# EAGLE board PC_PIC (EAGLE 7.7.0), part 1 of 2
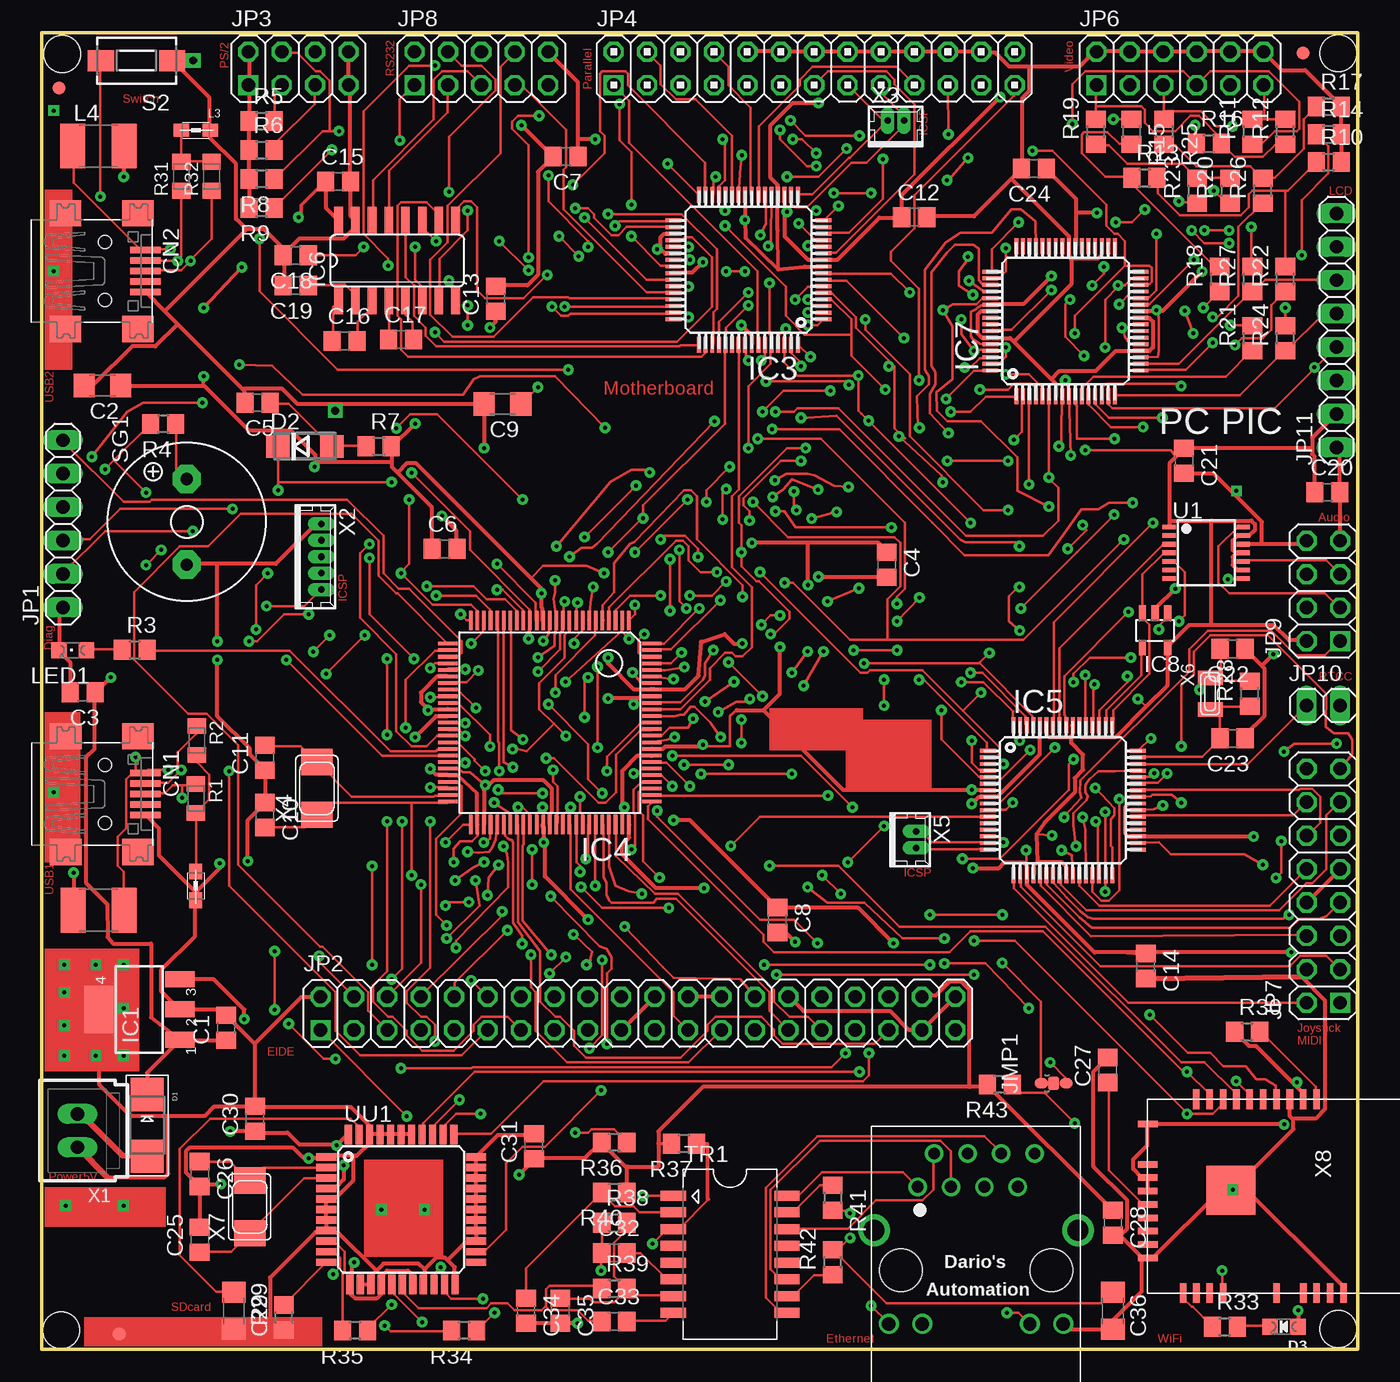
[diagram p3: board, top side]
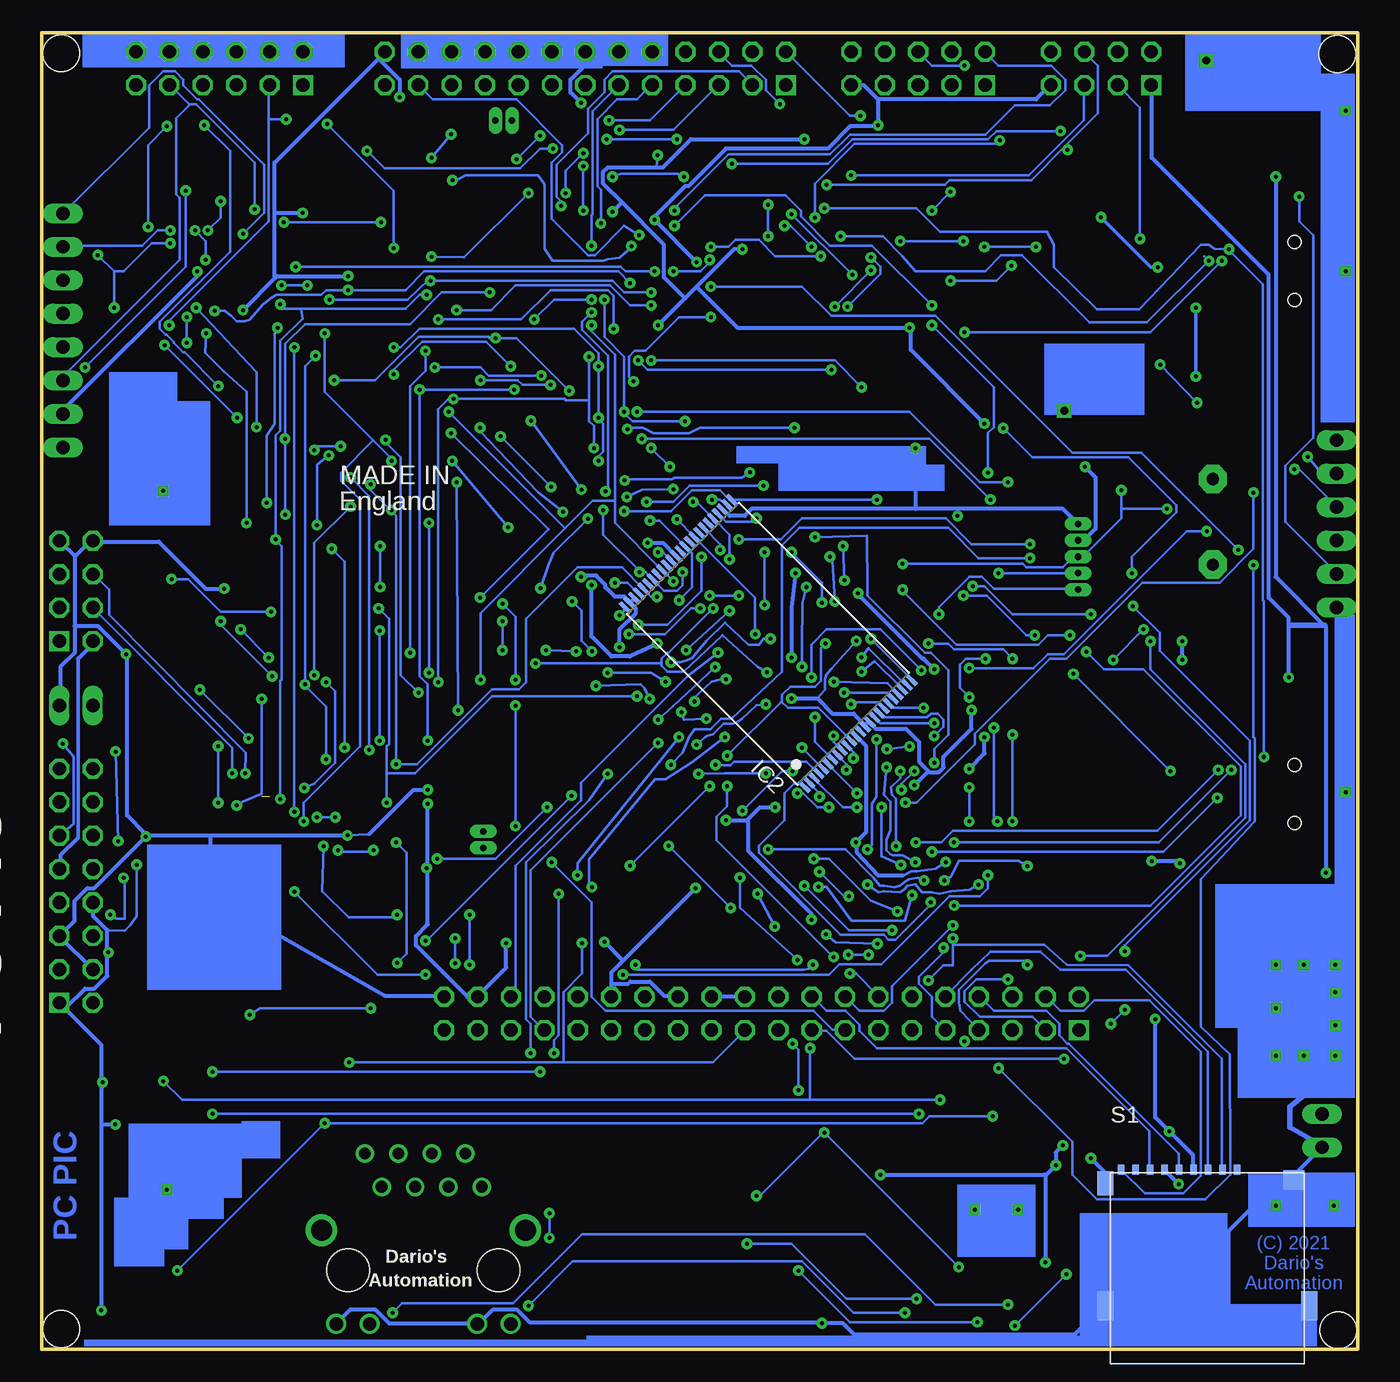
[diagram p4: board, bottom side, seen from below]

Size 100 x 100 mm. Coordinates in mm from the lower left corner, seen from the top.
Outline: 0,100 100,100 100,0 0,0 0,100
Copper layers (1*16): Top 0.035mm / dielectric 1.5mm / Bottom 0.035mm
Design rules "default *": minimum track width 8mil, minimum drill 12mil, track to track 6mil, track to pad 6mil, pad to pad 6mil, via to via 6mil, smd to smd 6mil, copper to edge 30mil, drill to drill 12mil, minimum pad ring 10mil, minimum via ring 10mil, stop-mask expansion 1mil, vias tented up to drill 0mil, thermal gap 10mil
Net classes: 1 +3V3: width 0.305 mm, clearance 0.152 mm; 2 VBUS: width 0.305 mm, clearance 0.152 mm; 4 GND: width 0.305 mm, clearance 0.152 mm; 5 +5V: width 0.305 mm, clearance 0.152 mm; 6 USBVCC: width 0.305 mm, clearance 0.152 mm
Holes 2.8 mm at 98.54,98.46 98.54,1.52 1.54,98.4 1.47,1.44

## Footprints (pad centres in the part's own frame; a part is rotated, then mirrored left to right if it is on the bottom)
C0805 = smd 1.3 x 1.5: 1 -0.95,0; 2 0.95,0
C1206 = smd 1.6 x 1.8: 1 -1.4,0; 2 1.4,0
USB-MINIB = smd 0.5 x 2.308: D+ 0,4.064; D- -0.8,4.064; GND 1.6,4.064; ID 0.8,4.064; VBUS -1.6,4.064 | smd 2 x 2.4: GND1 -4.4,-2; GND2 -4.4,3.5; GND3 4.4,3.5; GND4 4.4,-2 | hole 1: -2.2,1; 2.2,1
SMADIODE = smd 2.54 x 2.54: A 2.349,0; C -2.349,0
DO214AC = smd 1.8 x 1.7: A 2.05,0; C -2.05,0
CHIPLED_0805_NOOUTLINE = smd 1.2 x 1.2: A 0,-1.05; C 0,1.05
FIDUCIAL_1MM = smd 1 x 1: 1 0,0
SOT223 = smd 1.219 x 2.235: 1 -2.311,-3.099; 2 0,-3.099; 3 2.311,-3.099 | smd 3.6 x 2.2: 4 0,3.099
TSOP48 = smd 1.1 x 0.3: 1 -9.625,5.75; 2 -9.625,5.25; 3 -9.625,4.75; 4 -9.625,4.25; 5 -9.625,3.75; 6 -9.625,3.25; 7 -9.625,2.75; 8 -9.625,2.25; 9 -9.625,1.75; 10 -9.625,1.25; 11 -9.625,0.75; 12 -9.625,0.25; 13 -9.625,-0.25; 14 -9.625,-0.75; 15 -9.625,-1.25; 16 -9.625,-1.75; 17 -9.625,-2.25; 18 -9.625,-2.75; 19 -9.625,-3.25; 20 -9.625,-3.75; 21 -9.625,-4.25; 22 -9.625,-4.75; 23 -9.625,-5.25; 24 -9.625,-5.75; 25 9.625,-5.75; 26 9.625,-5.25; 27 9.625,-4.75; 28 9.625,-4.25; 29 9.625,-3.75; 30 9.625,-3.25; 31 9.625,-2.75; 32 9.625,-2.25; 33 9.625,-1.75; 34 9.625,-1.25; 35 9.625,-0.75; 36 9.625,-0.25; 37 9.625,0.25; 38 9.625,0.75; 39 9.625,1.25; 40 9.625,1.75; 41 9.625,2.25; 42 9.625,2.75; 43 9.625,3.25; 44 9.625,3.75; 45 9.625,4.25; 46 9.625,4.75; 47 9.625,5.25; 48 9.625,5.75
TQFP64-10X10 = smd 1.2 x 0.3: 1 -5.7,3.75; 2 -5.7,3.25; 3 -5.7,2.75; 4 -5.7,2.25; 5 -5.7,1.75; 6 -5.7,1.25; 7 -5.7,0.75; 8 -5.7,0.25; 9 -5.7,-0.25; 10 -5.7,-0.75; 11 -5.7,-1.25; 12 -5.7,-1.75; 13 -5.7,-2.25; 14 -5.7,-2.75; 15 -5.7,-3.25; 16 -5.7,-3.75; 33 5.7,-3.75; 34 5.7,-3.25; 35 5.7,-2.75; 36 5.7,-2.25; 37 5.7,-1.75; 38 5.7,-1.25; 39 5.7,-0.75; 40 5.7,-0.25; 41 5.7,0.25; 42 5.7,0.75; 43 5.7,1.25; 44 5.7,1.75; 45 5.7,2.25; 46 5.7,2.75; 47 5.7,3.25; 48 5.7,3.75 | smd 0.3 x 1.2: 17 -3.75,-5.7; 18 -3.25,-5.7; 19 -2.75,-5.7; 20 -2.25,-5.7; 21 -1.75,-5.7; 22 -1.25,-5.7; 23 -0.75,-5.7; 24 -0.25,-5.7; 25 0.25,-5.7; 26 0.75,-5.7; 27 1.25,-5.7; 28 1.75,-5.7; 29 2.25,-5.7; 30 2.75,-5.7; 31 3.25,-5.7; 32 3.75,-5.7; 49 3.75,5.7; 50 3.25,5.7; 51 2.75,5.7; 52 2.25,5.7; 53 1.75,5.7; 54 1.25,5.7; 55 0.75,5.7; 56 0.25,5.7; 57 -0.25,5.7; 58 -0.75,5.7; 59 -1.25,5.7; 60 -1.75,5.7; 61 -2.25,5.7; 62 -2.75,5.7; 63 -3.25,5.7; 64 -3.75,5.7
TQFP100-14X14 = smd 0.27 x 1.5: 1 -6,-7.75; 2 -5.5,-7.75; 3 -5,-7.75; 4 -4.5,-7.75; 5 -4,-7.75; 6 -3.5,-7.75; 7 -3,-7.75; 8 -2.5,-7.75; 9 -2,-7.75; 10 -1.5,-7.75; 11 -1,-7.75; 12 -0.5,-7.75; 13 0,-7.75; 14 0.5,-7.75; 15 1,-7.75; 16 1.5,-7.75; 17 2,-7.75; 18 2.5,-7.75; 19 3,-7.75; 20 3.5,-7.75; 21 4,-7.75; 22 4.5,-7.75; 23 5,-7.75; 24 5.5,-7.75; 25 6,-7.75; 51 6,7.75; 52 5.5,7.75; 53 5,7.75; 54 4.5,7.75; 55 4,7.75; 56 3.5,7.75; 57 3,7.75; 58 2.5,7.75; 59 2,7.75; 60 1.5,7.75; 61 1,7.75; 62 0.5,7.75; 63 0,7.75; 64 -0.5,7.75; 65 -1,7.75; 66 -1.5,7.75; 67 -2,7.75; 68 -2.5,7.75; 69 -3,7.75; 70 -3.5,7.75; 71 -4,7.75; 72 -4.5,7.75; 73 -5,7.75; 74 -5.5,7.75; 75 -6,7.75 | smd 1.5 x 0.27: 26 7.75,-6; 27 7.75,-5.5; 28 7.75,-5; 29 7.75,-4.5; 30 7.75,-4; 31 7.75,-3.5; 32 7.75,-3; 33 7.75,-2.5; 34 7.75,-2; 35 7.75,-1.5; 36 7.75,-1; 37 7.75,-0.5; 38 7.75,0; 39 7.75,0.5; 40 7.75,1; 41 7.75,1.5; 42 7.75,2; 43 7.75,2.5; 44 7.75,3; 45 7.75,3.5; 46 7.75,4; 47 7.75,4.5; 48 7.75,5; 49 7.75,5.5; 50 7.75,6; 76 -7.75,6; 77 -7.75,5.5; 78 -7.75,5; 79 -7.75,4.5; 80 -7.75,4; 81 -7.75,3.5; 82 -7.75,3; 83 -7.75,2.5; 84 -7.75,2; 85 -7.75,1.5; 86 -7.75,1; 87 -7.75,0.5; 88 -7.75,0; 89 -7.75,-0.5; 90 -7.75,-1; 91 -7.75,-1.5; 92 -7.75,-2; 93 -7.75,-2.5; 94 -7.75,-3; 95 -7.75,-3.5; 96 -7.75,-4; 97 -7.75,-4.5; 98 -7.75,-5; 99 -7.75,-5.5; 100 -7.75,-6
SO16 = smd 0.66 x 2.032: 1 -4.445,-3.073; 2 -3.175,-3.073; 3 -1.905,-3.073; 4 -0.635,-3.073; 5 0.635,-3.073; 6 1.905,-3.073; 7 3.175,-3.073; 8 4.445,-3.073; 9 4.445,3.073; 10 3.175,3.073; 11 1.905,3.073; 12 0.635,3.073; 13 -0.635,3.073; 14 -1.905,3.073; 15 -3.175,3.073; 16 -4.445,3.073
SOT23-5L = smd 0.55 x 1.2: 1 -0.95,-1.3; 2 0,-1.3; 3 0.95,-1.3; 4 0.95,1.3; 5 -0.95,1.3
C0R-JMP = smd 0.8 x 1: 1 0,0.938; 3 0,-0.938 | smd 1 x 0.8: 2 0,0
1X06 = drill 1.016 long: 1 -6.35,0; 2 -3.81,0; 3 -1.27,0; 4 1.27,0; 5 3.81,0; 6 6.35,0
2X20 = drill 1.016 square: 1 -24.13,-1.27 | drill 1.016 octagon: 2 -24.13,1.27; 3 -21.59,-1.27; 4 -21.59,1.27; 5 -19.05,-1.27; 6 -19.05,1.27; 7 -16.51,-1.27; 8 -16.51,1.27; 9 -13.97,-1.27; 10 -13.97,1.27; 11 -11.43,-1.27; 12 -11.43,1.27; 13 -8.89,-1.27; 14 -8.89,1.27; 15 -6.35,-1.27; 16 -6.35,1.27; 17 -3.81,-1.27; 18 -3.81,1.27; 19 -1.27,-1.27; 20 -1.27,1.27; 21 1.27,-1.27; 22 1.27,1.27; 23 3.81,-1.27; 24 3.81,1.27; 25 6.35,-1.27; 26 6.35,1.27; 27 8.89,-1.27; 28 8.89,1.27; 29 11.43,-1.27; 30 11.43,1.27; 31 13.97,-1.27; 32 13.97,1.27; 33 16.51,-1.27; 34 16.51,1.27; 35 19.05,-1.27; 36 19.05,1.27; 37 21.59,-1.27; 38 21.59,1.27; 39 24.13,-1.27; 40 24.13,1.27
2X04 = drill 1.016 square: 1 -3.81,-1.27 | drill 1.016 octagon: 2 -3.81,1.27; 3 -1.27,-1.27; 4 -1.27,1.27; 5 1.27,-1.27; 6 1.27,1.27; 7 3.81,-1.27; 8 3.81,1.27
2X13 = drill 1.016 square: 1 -15.24,-1.27 | drill 1.016 octagon: 2 -15.24,1.27; 3 -12.7,-1.27; 4 -12.7,1.27; 5 -10.16,-1.27; 6 -10.16,1.27; 7 -7.62,-1.27; 8 -7.62,1.27; 9 -5.08,-1.27; 10 -5.08,1.27; 11 -2.54,-1.27; 12 -2.54,1.27; 13 0,-1.27; 14 0,1.27; 15 2.54,-1.27; 16 2.54,1.27; 17 5.08,-1.27; 18 5.08,1.27; 19 7.62,-1.27; 20 7.62,1.27; 21 10.16,-1.27; 22 10.16,1.27; 23 12.7,-1.27; 24 12.7,1.27; 25 15.24,-1.27; 26 15.24,1.27
2X06 = drill 1.016 square: 1 -6.35,-1.27 | drill 1.016 octagon: 2 -6.35,1.27; 3 -3.81,-1.27; 4 -3.81,1.27; 5 -1.27,-1.27; 6 -1.27,1.27; 7 1.27,-1.27; 8 1.27,1.27; 9 3.81,-1.27; 10 3.81,1.27; 11 6.35,-1.27; 12 6.35,1.27
2X08 = drill 1.016 square: 1 -8.89,-1.27 | drill 1.016 octagon: 2 -8.89,1.27; 3 -6.35,-1.27; 4 -6.35,1.27; 5 -3.81,-1.27; 6 -3.81,1.27; 7 -1.27,-1.27; 8 -1.27,1.27; 9 1.27,-1.27; 10 1.27,1.27; 11 3.81,-1.27; 12 3.81,1.27; 13 6.35,-1.27; 14 6.35,1.27; 15 8.89,-1.27; 16 8.89,1.27
2X05 = drill 1.016 square: 1 -5.08,-1.27 | drill 1.016 octagon: 2 -5.08,1.27; 3 -2.54,-1.27; 4 -2.54,1.27; 5 0,-1.27; 6 0,1.27; 7 2.54,-1.27; 8 2.54,1.27; 9 5.08,-1.27; 10 5.08,1.27
1X02 = drill 1.016 long: 1 -1.27,0; 2 1.27,0
1X08 = drill 1.016 long: 1 -8.89,0; 2 -6.35,0; 3 -3.81,0; 4 -1.27,0; 5 1.27,0; 6 3.81,0; 7 6.35,0; 8 8.89,0
L1812 = smd 1.9 x 3.4: 1 -1.95,0; 2 1.95,0
0805 = smd 1.2 x 1: 1 -1.1,0; 2 1.1,0
CHIPLED_0805 = smd 1.2 x 1.2: A 0,-1.05; C 0,1.05
CT/CN0805 = smd 1.2 x 1.4: 1 -1.1,0; 2 1.1,0
R0805 = smd 1.3 x 1.5: 1 -0.95,0; 2 0.95,0
MICROSD-PUSH-OUT = smd 0.5 x 0.75: 1 9.625,0.225; 2 8.525,0.225; 3 7.425,0.225; 4 6.325,0.225; 5 5.225,0.225; 6 4.125,0.225; 7 3.025,0.225; 8 1.925,0.225; CD 0.825,0.225 | smd 1.2 x 1.8: G1 -0.375,-0.8 | smd 1.2 x 2.2: G2 -0.375,-10.1; G4 15.125,-10.1 | smd 1.6 x 1.5: G3 13.95,-0.55
DTSM-3 = smd 2 x 1.6: 1 -2.7,0; 2 2.7,0
F/QMBIII = drill 0.914 pad 2.159 octagon: + 3.251,0; - -3.251,0
01LAN_RJ45_10/00_Y-G_STD = drill 0.889: 1 4.445,-6.325; 2 3.175,-8.865; 3 1.905,-6.325; 4 0.635,-8.865; 5 -0.635,-6.325; 6 -1.905,-8.865; 7 -3.175,-6.325; 8 -4.445,-8.865 | drill 1.016: 9 6.629,4.089; 10 4.089,4.089; 11 -4.089,4.089; 12 -6.629,4.089 | drill 1.6: 16 -7.747,-3.023; 17 7.747,-3.023 | hole 3.251: -5.715,0.025; 5.715,0.025
749013011 = smd 1.91 x 0.76: 1 -4.317,4.445; 2 -4.317,3.175; 3 -4.317,1.905; 4 -4.317,0.635; 5 -4.317,-0.635; 6 -4.317,-1.905; 7 -4.317,-3.175; 8 -4.317,-4.445; 9 4.317,-4.445; 10 4.317,-3.175; 11 4.317,-1.905; 12 4.317,-0.635; 13 4.317,0.635; 14 4.317,1.905; 15 4.317,3.175; 16 4.317,4.445
TSSOP14 = smd 0.35 x 1: 1 -1.95,-2.825; 2 -1.3,-2.825; 3 -0.65,-2.825; 4 0,-2.825; 5 0.65,-2.825; 6 1.3,-2.825; 7 1.95,-2.825; 8 1.95,2.825; 9 1.3,2.825; 10 0.65,2.825; 11 0,2.825; 12 -0.65,2.825; 13 -1.3,2.825; 14 -1.95,2.825
TQFP-44 = smd 1.5 x 0.55: 1 -5.7,4; 2 -5.7,3.2; 3 -5.7,2.4; 4 -5.7,1.6; 5 -5.7,0.8; 6 -5.7,0; 7 -5.7,-0.8; 8 -5.7,-1.6; 9 -5.7,-2.4; 10 -5.7,-3.2; 11 -5.7,-4; 23 5.7,-4; 24 5.7,-3.2; 25 5.7,-2.4; 26 5.7,-1.6; 27 5.7,-0.8; 28 5.7,0; 29 5.7,0.8; 30 5.7,1.6; 31 5.7,2.4; 32 5.7,3.2; 33 5.7,4 | smd 0.55 x 1.5: 12 -3.9,-5.7; 13 -3.1,-5.7; 14 -2.3,-5.7; 15 -1.5,-5.7; 16 -0.7,-5.7; 17 0.1,-5.7; 18 0.9,-5.7; 19 1.7,-5.7; 20 2.5,-5.7; 21 3.3,-5.7; 22 4.1,-5.7; 34 4,5.7; 35 3.2,5.7; 36 2.4,5.7; 37 1.6,5.7; 38 0.8,5.7; 39 0,5.7; 40 -0.8,5.7; 41 -1.6,5.7; 42 -2.4,5.7; 43 -3.2,5.7; 44 -4,5.7
70543-02 = drill 1.016 long: 1 -1.27,0; 2 1.27,0
53047-05 = drill 0.5 pad 0.698 long: 1 2.5,0.45; 2 1.25,0.45; 3 0,0.45; 4 -1.25,0.45; 5 -2.5,0.45
53047-02 = drill 0.5 pad 0.698 long: 1 0.625,0.45; 2 -0.625,0.45
NX5032 = smd 2 x 2.4: P$1 2,0; P$2 -2,0
XTAL3215 = smd 1.1 x 1.9: P$1 1.2,0; P$2 -1.2,0
ATWINC1500_MR210PA = smd 1.5 x 0.5: J1 7.146,-4.973; J2 7.146,-3.957; J3 7.146,-2.941; J4 7.146,-1.925; J5 7.146,2.139; J6 7.146,4.171; J7 7.146,5.187; J8 7.146,6.203; J9 7.146,7.219; J10 -7.584,5.181; J11 -7.584,4.165; J12 -7.584,3.149; J13 -7.584,2.133; J14 -7.584,1.117; J15 -7.584,0.101; J16 -7.584,-0.915; J17 -7.584,-1.931; J18 -7.584,-2.947; J19 -7.584,-3.963 | smd 0.5 x 1.5: J20 -5.684,-7.643; J21 -2.636,-7.663; J22 -1.62,-7.663; J23 -0.604,-7.663; J24 0.412,-7.663; J25 1.428,-7.643; J26 2.444,-7.643; J27 3.46,-7.643; J28 4.476,-7.643 | smd 3.7 x 3.7: MTGND -0.666,-1.331

## Placement (x,y rotation side)
C1  100n  [C0805]  14,24.4 90 top
C2  22u  [C1206]  4.6,73.2 180 top
C3  100n  [C0805]  3.1,49.9 180 top
C4  100n  [C0805]  64.2,59.6 270 top
C5  100n  [C0805]  16.4,71.9 180 top
C6  100n  [C0805]  30.6,60.8 0 top
C7  100n  [C0805]  39.8,90.6 180 top
C8  100n  [C0805]  55.9,32.6 270 top
C9  4.7uF  [C1206]  35,71.8 180 top
C10  22p  [C0805]  16.95,40.58 270 top
C11  22p  [C0805]  16.95,44.92 90 top
C12  100n  [C0805]  66.3,86 0 top
C13  100n  [C0805]  34.5,79.8 90 top
C14  100n  [C0805]  83.9,29.1 270 top
C15  100n  [C0805]  22.5,88.7 0 top
C16  100n  [C0805]  23,76.6 0 top
C17  100n  [C0805]  27.3,76.7 0 top
C18  100n  [C0805]  19.3,83.1 180 top
C19  100n  [C0805]  19.3,80.8 180 top
C20  100n  [C0805]  97.7,65.1 0 top
C21  100n  [C0805]  86.8,67.5 270 top
C22  22p  [C0805]  90.5,53.2 180 top
C23  22p  [C0805]  90.5,46.4 180 top
C24  100n  [C0805]  75.4,89.7 180 top
C25  22p  [C0805]  12,8.3 90 top
C26  22p  [C0805]  12,13.3 270 top
C27  1uF  [C0805]  81,21.2 90 top
C28  100n  [C0805]  81.4,9.6 270 top
C29  10uF  [C1206]  14.6,2.9 270 top
C30  100n  [C0805]  16.2,17.5 90 top
C31  100n  [C0805]  37.4,15.4 90 top
C32  6n8  [C0805]  43.5,7.3 0 top
C33  6n8  [C0805]  43.5,2.1 0 top
C34  10n  [C0805]  36.8,2.9 270 top
C35  10n  [C0805]  39.4,2.9 270 top
C36  1n 2KV  [C1206]  81.4,2.9 270 top
CN1  MiniUSB webcam/pendrive  [USB-MINIB]  3.81,42.16 270 top
CN2  MiniUSB keyboard/mouse  [USB-MINIB]  3.8,81.9 270 top
D1  1N4007  [SMADIODE]  8,17 270 top
D2  BAT42-SMD  [DO214AC]  19.98,68.58 0 top
D3  Red  [CHIPLED_0805_NOOUTLINE]  94.4,1.7 90 top
F1  FIDUCIAL  [FIDUCIAL_1MM]  1.31,95.8 0 top
F2  FIDUCIAL  [FIDUCIAL_1MM]  95.87,98.47 0 top
F3  FIDUCIAL  [FIDUCIAL_1MM]  5.88,1.14 0 top
IC1  MCP1825S-33  [SOT223]  7.4,25.8 90 top
IC2  AS6C6416  [TSOP48]  44.8,53.6 135 bottom
IC3  PIC24FJ256GB206  [TQFP64-10X10]  53.7,82 180 top
IC4  PIC32MZ2048EFG100  [TQFP100-14X14]  38.6,47.6 180 top
IC5  PIC32MZ1024EFE064512  [TQFP64-10X10]  77.6,41.7 0 top
IC6  MAX202ECWS  [SO16]  27,82.7 0 top
IC7  PIC32MZ1024EFE064512  [TQFP64-10X10]  77.8,78.1 90 top
IC8  TC77  [SOT23-5L]  84.6,54.6 180 top
JMP1  0R-JUMPC  [C0R-JMP]  76.9,20.2 90 top
JP1  Diag  [1X06]  1.6,62.7 90 top
JP2  EIDE/PATA/floppy  [2X20]  45.3,25.5 0 top
JP3  PS/2  [2X04]  19.5,97.3 0 top
JP4  Centronics  [2X13]  58.7,97.3 0 top
JP6  Video/VGA/Comp  [2X06]  86.5,97.3 0 top
JP7  Joystick/Midi  [2X08]  97.4,35.2 90 top
JP8  RS232  [2X05]  33.4,97.3 0 top
JP9  Audio/SPDIF  [2X04]  97.4,57.6 90 top
JP10  RTC  [1X02]  97.4,48.9 0 top
JP11  [1X08]  98.4,77.4 90 top
L1  500mA  [L1812]  4.32,33.34 180 top
L2  BLM21  [0805]  11.69,35.19 90 top
L3  BLM21  [0805]  11.7,92.6 180 top
L4  500mA  [L1812]  4.3,91.4 0 top
LED1  rosso  [CHIPLED_0805]  2.34,53.1 90 top
R1  VARISTORCN0805  [CT/CN0805]  11.72,41.84 270 top
R2  VARISTORCN0805  [CT/CN0805]  11.78,46.23 270 top
R3  470  [R0805]  7.06,53.12 0 top
R4  100  [R0805]  9.21,70.28 180 top
R5  2K2  [R0805]  16.7,93.3 0 top
R6  2K2  [R0805]  16.7,91.1 0 top
R7  10K  [R0805]  25.6,68.6 0 top
R8  2K2  [R0805]  16.7,88.9 180 top
R9  2K2  [R0805]  16.7,86.7 180 top
R10  470  [R0805]  97.8,90.2 0 top
R11  220  [R0805]  92,92.5 90 top
R12  220  [R0805]  94.5,92.5 90 top
R13  220  [R0805]  83.8,89 0 top
R14  470  [R0805]  97.8,92.3 0 top
R15  220  [R0805]  82.8,92.5 270 top
R16  470  [R0805]  88.7,91.6 0 top
R17  470  [R0805]  97.8,94.4 0 top
R18  470  [R0805]  89.5,81.3 90 top
R19  220  [R0805]  80.1,92.5 90 top
R20  470  [R0805]  90.3,88 90 top
R21  470  [R0805]  92,76.8 90 top
R22  470  [R0805]  94.5,81.3 90 top
R23  220  [R0805]  87.8,88 90 top
R24  470  [R0805]  94.5,76.8 90 top
R25  220  [R0805]  85.3,92.5 270 top
R26  470  [R0805]  92.8,88 90 top
R27  470  [R0805]  92,81.3 90 top
R28  1M  [R0805]  91.8,49.8 90 top
R29  12K4 1%  [R0805]  18.4,2.4 90 top
R30  1M  [R0805]  91.6,24.1 0 top
R31  VARISTORCN0805  [CT/CN0805]  10.6,89.1 90 top
R32  VARISTORCN0805  [CT/CN0805]  12.9,89.1 90 top
R33  1K  [R0805]  89.9,1.7 0 top
R34  220  [R0805]  32.1,1.4 180 top
R35  220  [R0805]  23.8,1.4 180 top
R36  49.9 1%  [R0805]  43.5,15.7 180 top
R37  49.9 1%  [R0805]  48.8,15.6 180 top
R38  49.9 1%  [R0805]  43.5,9.6 0 top
R39  49.9 1%  [R0805]  43.5,4.6 0 top
R40  10 1%  [R0805]  43.5,11.9 180 top
R41  75 1%  [R0805]  60.1,11.5 270 top
R42  75 1%  [R0805]  60.1,6.6 90 top
R43  10K  [R0805]  72.8,20.1 180 top
S1  MICROSD-PUSH-OUT  [MICROSD-PUSH-OUT]  18.8,13.4 0 bottom
S2  DTSM-3  [DTSM-3]  7.2,97.9 180 top
SG1  F/QMBIII  [F/QMBIII]  11.01,62.85 90 top
T1  7499011121  [01LAN_RJ45_10/00_Y-G_STD]  71,6 180 top
TR1  [749013011]  52.3,7.2 0 top
U1  MCP4922TSSOP  [TSSOP14]  88.5,60.5 270 top
UU1  ENC424J600  [TQFP-44]  27.3,10.6 0 top
X1  C-GRID-02-70543  [70543-02]  2.7,16.6 90 top
X2  53047-05  [53047-05]  20.8,60.2 270 top
X3  53047-02  [53047-02]  64.9,92.9 0 top
X4  24MHz  [NX5032]  20.9,42.6 90 top
X5  53047-02  [53047-02]  66,38.7 270 top
X6  32768  [XTAL3215]  88.8,49.8 270 top
X7  25MHz  [NX5032]  15.8,10.8 90 top
X8  ATWINC1500_MR210PB  [ATWINC1500_MR210PA]  91.7,11.4 270 top

## Tracks (layer width: path | path; a pad name or v marks a point on that pad's centre or on a via)
+3V3  (via drill 0.3, 0.3 pad 0.2, 0.3 pad 0.25, 0.3 pad 0.3)
  Top 0.203: IC5.26 78.3,37.5 v77.5,37.9 | v74.8,37.9 74.85,36.5 | IC5.39 84.5,41 v85.2,41.3 | v83.3,49.4 83.96,48.84 | IC3.26 53.1,89.79 v53.2,90.7 | IC7.60 71.3,76.4 70.7,76.8 70.6,77 70.6,78.8 71,79 71.1,79.1 71.4,79.3 IC7.54 | IC7.19 84.8,75.4 84.9,75.8 84.9,78.4 v84.72,78.94 | IC7.8 77.5,70.5 77.5,69 v77.3,68.6 | v79.3,68.3 85.8,68.3 86.2,67.8 | v42.73,58.96 41.4,59.5 38.1,59.5 37.17,58.57 | 33.07,39.74 33.1,39 32.7,38.6 31.8,38.6 31.3,38 v31.3,37 | IC5.34 84.9,38.5 85.8,37.6 91.4,37.6 v92.8,36.8
  Top 0.254: 30.94,43.56 31.64,43.56 33.07,42.23 | C15.1 21.5,88.7 19.7,86.9 19.7,86.2 v19.5,86 | v15.2,82.2 v12.3,79.1 | v12.3,73.9 12.2,73.17 | R37.2 46.85,15.6
  Top 0.305: IC4.62 38.05,39.83 38.05,39.74 38.14,39.65 v38.14,38.49 38.23,38.41 38.23,35.92 v41.52,32.63 | 33.07,42.23 33.07,39.92 IC4.52 33.07,39.74 | 30.94,43.56 IC4.46 30.76,43.65 29.96,43.65 v29.52,44.09 | v28.36,46.49 29.96,48.09 IC4.37 | IC5.60 75.83,47.38 75.83,45.16 72.63,41.96 71.92,41.96 IC5.8 71.83,41.96 71.21,41.96 v70.67,41.43 | 44.09,41.16 44.09,43.92 45.25,45.07 46.32,45.07 IC4.83 | 44.09,41.16 44.09,39.92 IC4.74 | v64.72,30.85 62.05,33.52 55.92,33.52 C8.1 55.83,33.6 49.25,40.18 v48.01,40.18 | v44.27,41.16 44.09,41.16 | v70.76,36.54 72.72,36.54 73.17,36.98 74.59,36.98 74.85,36.72 74.85,36.5 74.85,36.09 IC5.19 74.85,35.92 74.85,35.29 80.01,30.14 82.5,30.14 C14.1 82.59,30.14 v94.94,30.14 | UU1.18 28.18,4.98 28.18,5.6 27.83,5.96 26.23,5.96 25.87,5.6 25.87,4.98 UU1.15 25.78,4.89 25.78,4.18 25.43,3.82 23.82,3.82 23.47,4.18 23.47,4.89 UU1.12 23.56,4.98 23.56,6.4 v23.74,6.58 | v22.94,13.96 22.94,12.89 22.31,12.27 21.6,12.27 UU1.4 | UU1.44 23.29,16.36 v22.4,15.47 22.31,15.56 19.56,15.56 18.67,16.45 16.27,16.45 C30.1 16.18,16.54 v14.31,16.54 | v15.38,25.07 15.38,25.78 13.07,28.09 10.58,28.09 IC1.3 | 44.45,13.78 R40.1 | 44.45,13.78 42.58,15.65 R36.2 42.41,15.65 41.25,14.49 37.43,14.49 C31.1 37.34,14.31 v36.27,13.25 | 44.45,13.78 44.54,13.87 46.85,13.87 46.85,15.6 46.85,16.54 50.23,19.91 70.5,19.91 | C28.1 81.34,10.58 71.83,20.09 R43.2 71.83,19.91 70.5,19.91 | 70.5,19.91 70.5,27.29 69.88,27.91 68.99,27.91 67.92,26.85 66.94,26.85 JP2.38 | 56.45,86.41 56.45,87.66 IC3.19 | 56.45,86.41 56.45,84.54 58.23,82.77 59.38,82.77 IC3.10 59.47,82.77 60.45,82.77 63.65,85.97 65.34,85.97 C12.1 65.34,86.14 65.34,87.66 v72.81,95.12
  Top 0.305: 40.72,91.92 40.72,96.28 38.49,98.5 JP8.10 | 40.72,91.92 40.72,90.68 C7.1 | v53.16,77.79 53.96,76.99 53.96,76.36 IC3.57 | IC3.38 47.92,83.21 47.38,83.21 47.03,83.57 v46.76,83.57 47.03,83.66 47.03,84.45 47.3,84.72 47.92,84.72 IC3.35 | v34.05,77.61 34.49,78.05 34.49,78.77 C13.1 | v42.05,91.92 40.72,91.92 | v56.63,86.41 56.45,86.41 | 27.03,66.59 26.58,67.03 26.58,67.39 | 27.03,66.59 29.6,64.01 29.6,60.81 C6.1 | 26.58,67.39 26.58,68.54 R7.2 26.67,68.63 v28.36,70.32 | 21.07,67.39 20.8,67.65 20.8,67.92 18.94,69.79 15.73,69.79 12.36,73.17 12.2,73.17 6.04,73.17 C2.1 | 26.58,67.39 21.07,67.39 | 21.07,67.39 v20.71,67.03 | 58.23,61.25 63.56,61.25 64.19,60.63 C4.1 | 58.23,61.25 v53.96,61.25 | v32.18,51.65 30.94,51.65 IC4.30 | IC4.14 38.05,55.38 38.05,56.27 37.96,56.36 v37.96,57.43 38.05,57.7 37.17,58.57 28.45,67.3 27.74,67.3 27.03,66.59 | v43.03,52.54 43.03,52.09 44.98,50.14 46.32,50.14 IC4.93 46.49,50.14 48.9,50.14 49.92,51.16 50.12,53.76 50.07,53.72 51.88,54.32 52.59,53.61 v53.23,53.61 | v58.23,58.05 58.23,61.25 | 95.21,20.09 92.28,23.02 91.75,23.02 90.68,24.09 R30.1 | 95.21,20.09 95.83,19.47 95.83,19.02 X8.J11 | JP7.8 96.19,33.96 98.68,36.45 JP7.9 | X8.J23 84.01,12.09 84.01,12.98 X8.J22 83.92,13.07 83.57,13.07 82.94,13.69 82.94,14.4 84.01,15.47 84.01,17.07 X8.J20 84.19,17.07 v94.41,17.07 | v95.48,2.93 95.48,1.78 D3.A | v95.39,20.27 95.21,20.09 | 90.77,60.45 90.5,60.19 90.5,59.56 90.86,59.21 91.3,59.21 U1.9 | 90.77,60.45 91.3,60.45 U1.11 | 90.77,60.45 90.5,60.72 90.5,61.43 90.86,61.78 91.3,61.78 U1.13 91.48,61.78 91.75,61.78 92.19,62.23 92.19,62.67 91.92,62.94 88.9,62.94
  Top 0.305: 85.7,62.94 85.7,67.3 86.2,67.8 86.77,68.36 C21.1 86.94,68.45 96.55,68.45 | 85.7,62.94 85.7,62.5 U1.1 | 85.7,62.94 88.9,62.94 | IC5.54 78.85,47.38 78.85,46.67 79.03,46.49 81.61,46.49 83.96,48.84 85.52,50.41 85.52,53.25 IC8.5 85.61,53.43 87.21,55.03 88.9,55.03 | 88.9,55.03 93.61,55.03 94.77,53.87 96.1,53.87 JP9.2 | 88.9,55.03 88.9,62.94 | 78.59,86.32 78.59,87.39 76.36,89.61 C24.1 | 78.59,86.32 78.59,83.83 IC7.39 | 84.72,78.85 85.17,78.85 v88.19,81.88 | 84.72,78.85 83.57,78.85 IC7.26 | v76.72,81.52 74.59,79.39 72.19,79.39 IC7.54 | v84.72,78.94 84.72,78.85 | 96.55,68.45 96.55,69.25 98.32,71.03 JP11.2 | 96.55,68.45 96.55,68.01 96.72,67.83 96.72,65.16 C20.1 | v80.19,86.32 78.59,86.32
  Bottom 0.203: v77.5,37.9 77.7,37.8 74.9,37.8 v74.8,37.9 | v85.2,41.3 85.2,41.4 83.3,42.2 v83.3,49.4 | v53.2,90.7 53.3,89.79 | v77.3,68.6 79.1,68.6 v79.3,68.3 | 34.56,35.97 33.9,36.3 33.5,36.3 32.1,36.5 v31.3,37 | v92.8,36.8 92.8,32.9 93.3,32.2 93.7,31.8 95.03,31.83
  Bottom 0.254: 97.26,52.45 97.26,38.85 | v19.5,86 15.7,82.2 v15.2,82.2 | v12.3,79.1 v12.3,73.9
  Bottom 0.305: IC2.12 38.14,46.58 37.34,45.78 37.34,39.29 v38.14,38.49 38.05,38.41 38.05,37.69 36.43,35.97 34.56,35.97 | v28.36,46.49 28.36,45.25 v29.52,44.09 | v64.72,30.85 64.72,28.98 66.85,26.85 JP2.38 67.03,26.76 67.65,26.76 71.56,30.67 71.56,31.38 70.67,32.27 70.67,36.54 | v44.27,41.16 45.43,41.16 46.41,40.18 | v48.01,40.18 46.41,40.18 | 70.67,36.54 v70.67,41.43 | v70.76,36.54 70.67,36.54 | v41.52,32.63 41.52,33.07 46.32,37.87 46.32,40.09 46.41,40.18 | v22.4,15.47 22.94,14.94 v22.94,13.96 23.74,13.16 | 23.74,13.16 v23.74,6.58 | S1.4 12.54,13.69 12.54,14.76 v14.31,16.54 15.38,17.6 v15.38,25.07 | v36.27,13.25 23.82,13.25 23.74,13.16 | 50.23,80.72 47.38,83.57 v46.76,83.57 | 50.23,80.72 51.12,79.83 | 51.12,79.83 v53.16,77.79 | 50.23,80.72 47.12,77.61 v34.05,77.61 33.96,77.52 33.96,75.92 v28.36,70.32 | v42.05,91.92 50.67,91.92 52.81,89.79 53.3,89.79 56.98,89.79 57.34,89.43 57.34,88.54 55.92,87.12 | 55.92,87.12 52.72,83.92 52.72,81.43 51.12,79.83 | 55.92,87.12 v56.63,86.41 | v20.71,67.03 19.91,66.23 19.91,62.32 20.71,61.52 21.25,61.52 X2.4 | v53.96,61.25 52.81,61.25 51.83,60.27 IC2.37 | v32.18,51.65 32.98,52.45 33.07,52.45 37.96,57.34 v37.96,57.43 | v43.03,52.54 43.03,56.36 v42.73,58.96 | v58.23,58.05 58.23,54.14 56.72,52.63 55.31,52.63 v53.23,53.61 | 95.48,20.27 95.48,23.11 98.59,26.23 JP7.1 98.15,25.96 96.72,27.38 96.01,27.38 95.03,28.36 95.03,30.14 | 95.48,20.27 95.48,17.07 | 95.48,17.07 v95.48,2.93 | 95.48,17.07 v94.41,17.07 | 95.03,30.14 95.03,31.83 96.1,32.89 96.1,33.87 JP7.8 | v95.39,20.27 95.48,20.27 | v88.19,81.88 88.19,81.52 98.32,71.39 98.32,71.12 JP11.2 | v76.72,81.52 82.14,81.52 82.23,81.43
  Bottom 0.305: v84.72,78.94 82.23,81.43 | 82.32,86.32 82.32,81.52 82.23,81.43 | 82.32,86.32 82.32,90.14 73.97,98.5 JP4.26 74.32,97.97 72.81,96.46 v72.81,95.12 | 82.32,86.32 v80.19,86.32 | 97.26,38.85 98.59,37.52 98.59,36.54 JP7.9 | 97.26,52.45 96.19,53.52 96.19,53.78 JP9.2 | v94.94,30.14 95.03,30.14
+5V  (via drill 0.3)
  Top 0.305: R9.2 15.73,86.77 15.73,88.9 R8.2 15.73,88.99 15.73,91.03 R6.1 15.73,91.21 15.73,93.26 R5.1 15.73,93.43 15.73,95.92 JP3.1 15.73,96.1 15.73,98.5 JP3.2 | 10.49,23.56 IC1.1 | C1.1 13.96,23.47 10.58,23.47 IC1.1 | D1.C 8,19.38 8,20.98 10.4,23.38 IC1.1 | v5.25,51.03 4.18,49.96 C3.1 4,49.87 4,45.61 3.38,44.98 3.38,35.38 4.98,33.78 5,31.3 5.4,30.8 8.3,30.8 8.3,25.2 IC1.1
  Bottom 0.305: v5.25,51.03 5.25,55.56 6.76,57.07 6.76,81.61 15.65,90.5 15.65,96.01 JP3.1
ACS  (via drill 0.3 pad 0.3)
  Top 0.203: IC4.56 35.2,39 35.4,38.8 35.6,38.7 35.7,38.7 35.8,38.5 35.8,32.4 36.5,31.4 v36.5,30.8 | v40.4,31.5 41.8,30.2 41.7,29.7 41.7,29.5 v41.4,29.2 | v54.9,29.2 v67.5,29.2 67.6,29.2 | IC5.45 81.6,43.9 80.3,43.9 79.6,43.3 79.4,43 79.3,42.8 79.3,42.3 79.5,42 79.4,41.7 78.4,40.7 78.4,39.8 v78.6,38.2 | v73,33 v67.5,33
  Bottom 0.203: v36.5,30.8 39.7,30.9 v40.4,31.5 | v41.4,29.2 41.7,28.9 42.1,28.8 54.7,28.8 v54.9,29.2 | v78.6,38.2 78.7,34.8 76.7,32.8 73.2,32.8 v73,33 | v67.5,33 v67.5,29.2
AIRQ  (via drill 0.3)
  Top 0.203: v52.36,38.23 54.59,40.45 71.83,40.45 IC5.11 | v47.65,33.52 42.58,33.52 v40.98,35.12 | v33.86,34.48 33.96,35.83 v34.72,36.78 | v36.18,41.16 36.54,41.16 37.07,40.63 37.07,39.92 IC4.60
  Bottom 0.203: v47.65,33.52 v52.36,38.23 | v40.98,35.12 40.36,35.12 38.48,32.54 34.4,32.54 v33.86,34.48 | v34.72,36.78 36.18,37.45 v36.18,41.16
ALDAC  (via drill 0.3)
  Top 0.203: v90.14,58.5 91.3,58.5 U1.8 | v82.59,56.01 77.7,51.12 77.7,48.18 77.79,48.09 77.79,47.47 IC5.56
  Bottom 0.203: v90.14,58.5 88.9,58.5 86.41,56.01 v82.59,56.01
ASCK
  Top 0.203: U1.4 85.61,60.45 85.25,60.45 83.66,58.85 83.66,55.92 IC8.3 83.66,55.83 83.66,55.56 84.19,55.03 84.19,51.3 81.43,48.54 81.43,47.47 IC5.49
ASCS
  Top 0.203: U1.3 85.61,61.07 85.17,61.07 77.34,53.25 77.34,47.47 IC5.57
ASDI
  Top 0.203: IC5.50 80.9,47.47 80.9,48.54 83.57,51.21 83.57,53.25 IC8.4
ASDO  (via drill 0.3)
  Top 0.203: v86.41,55.3 86.86,55.74 86.86,59.03 86.06,59.83 85.7,59.83 U1.5 | v82.5,51.12 82.5,50.67 80.37,48.54 80.37,47.47 IC5.51
  Bottom 0.203: v86.41,55.3 86.41,55.03 v82.5,51.12
AUXRESET  (via drill 0.3)
  Top 0.203: v72.99,29.34 75.92,26.4 75.92,20.27 JMP1.1 | v73.08,38.49 72.63,38.94 71.92,38.94 IC5.14
  Bottom 0.203: v72.99,29.34 72.28,30.05 72.28,37.69 v73.08,38.49
BA0  (via drill 0.3)
  Top 0.203: v56.45,58.23 57.07,58.23 61.43,53.87 64.28,53.87 | 64.28,53.87 74.59,53.87 v82.23,61.52 | v81.88,79.39 82.77,80.28 83.48,80.28 IC7.29 | v51.74,91.92 51.92,91.75 51.92,88.81 51.47,88.37 51.47,87.74 IC3.29 | v57.07,91.92 57.78,91.92 v58.85,90.86 | v63.03,87.83 v60.19,87.83 | v81.88,41.78 81.88,34.85 81.08,34.05 80.54,34.05 79.83,34.76 79.83,35.92 IC5.29 | v32.18,44.54 30.94,44.54 IC4.44 | v45.16,65.61 v41.25,61.7 | v54.05,64.36 56.72,61.7 64.81,61.7 65.25,61.25 65.25,57.96 64.28,56.98 64.28,53.87 | v70.76,80.1 69.7,80.8 69.7,81.9 70.3,82.7 v70.4,83
  Bottom 0.203: v56.45,58.23 55.47,58.23 54.67,57.43 IC2.45 | v57.07,91.92 v51.74,91.92 | v58.85,90.86 60.19,89.52 v60.19,87.83 | v63.03,87.83 67.92,82.94 v70.4,83 | v70.76,80.1 71.3,80.1 72.36,79.03 80.3,79.03 | 80.3,79.03 81.79,79.03 v81.88,79.39 | v81.88,41.78 81.88,50.76 81.79,50.85 81.79,60.98 82.23,61.43 v82.23,61.52 82.23,69.43 81.88,69.79 81.9,76.6 80.2,78.3 80.3,79.03 | v32.18,44.54 32.18,45.61 31.11,46.67 31.11,51.56 32.45,52.9 32.89,52.9 37.25,57.25 37.25,57.7 37.3,61.8 v41.25,61.7 | v45.16,65.61 50.76,65.61 52.01,64.36 v54.05,64.36
BA1  (via drill 0.3)
  Top 0.203: v55.74,63.65 56.45,63.65 57.27,62.43 v64.56,62.43 | v73.43,67.47 v68.81,67.47 | v78.5,77.17 78.5,78.5 82.32,82.32 | 82.32,82.32 84.19,82.32 84.37,82.14 84.37,81.08 84.19,80.9 83.57,80.9 IC7.30 | v51.21,89.08 51.03,88.9 51.03,87.74 IC3.30 | v56.63,89.08 59.03,89.08 v61.16,91.21 | v75.3,91.03 76.81,91.03 80.9,86.94 80.9,85.34 81.52,84.72 81.79,84.72 82.32,84.19 82.32,82.32 | v80.1,40.09 80.28,39.92 80.28,36.01 IC5.30 | v18.58,52.36 25.87,45.07 30.85,45.07 IC4.43 | v16.27,54.67 16.27,58.05 v17.16,58.94 | v26.94,69.96 28,71.03 30.05,71.03 v36.54,64.54
  Bottom 0.203: v55.74,63.65 52.18,63.65 50.58,65.25 48.45,65.25 47.74,64.54 47.56,64.54 IC2.25 47.47,64.54 v36.54,64.54 | v68.81,67.47 v64.56,62.43 | v73.43,67.47 73.43,67.65 74.81,69.03 | 74.81,69.03 78.5,72.72 v78.5,77.17 | v61.16,91.21 62.14,91.21 63.65,89.7 73.97,89.7 v75.3,91.03 | v80.1,40.09 80.1,41.52 75.83,45.78 75.83,64.54 77.25,65.96 77.25,66.59 74.81,69.03 | v16.27,54.67 v18.58,52.36 | v17.16,58.94 17.16,60.19 13.78,63.56 13.78,64.1 17.42,67.74 24.71,67.74 v26.94,69.96 | v51.21,89.08 51.7,89.3 56,89.3 v56.63,89.08
BA2  (via drill 0.3)
  Top 0.203: v36.98,53.96 36.98,54.5 37.07,54.59 37.07,55.3 IC4.16 37.07,55.38 37.07,56.19 32.54,60.72 32.54,62.14 v28.09,66.59 | 61.52,77.08 61.52,75.48 v64.1,72.9 | 61.52,77.08 61.52,78.23 60.01,79.74 59.47,79.74 IC3.4 | v71.3,72.9 73.43,72.9 73.88,73.34 75.21,73.34 75.48,73.08 75.48,72.45 IC7.4 | v70.67,46.23 70.67,44.54 71.21,44.01 71.83,44.01 IC5.4 | v32.36,79.3 v32.36,77.79 | v51.92,85.34 56.54,80.72 56.54,78.5 57.96,77.08 61.52,77.08
  Bottom 0.203: v36.98,53.96 33.96,50.94 IC2.24 | v64.1,72.9 v71.3,72.9 71.3,51.12 70.67,50.49 v70.67,46.23 | v28.09,66.59 28.09,69.61 27.65,70.05 27.65,73.08 v32.36,77.79 | v32.36,79.3 36.89,83.83 40.09,83.83 42.32,86.06 42.32,86.5 43.47,87.66 49.61,87.66 v51.92,85.34
BA3  (via drill 0.3, 0.3 pad 0.2)
  Top 0.203: v68.36,48.54 68.36,46.32 71.21,43.47 71.83,43.47 IC5.5 | v68.46,65.86 68.36,66.41 v65.14,69.34 65.59,69.19 64.81,69.96 64.81,74.68 64.59,74.9 | 64.59,74.9 61.87,77.61 61.87,78.41 60.1,80.19 59.47,80.19 IC3.5 | v73.25,74.05 75.03,74.05 76.01,73.08 76.01,72.45 IC7.5 | 64.59,74.9 v64.36,74.68 | v37.69,52.55 38.96,53.42 38.95,54.22 39.03,54.5 39.03,55.3 IC4.12 38.9,57 39,57.5 v39,58.4 | v39.1,61 43.2,65.9 44.8,66.8 45.8,66.8 v46.2,66.6 | v55.7,66 56.6,66.5 58.2,66.5 58.7,66.4 60.2,65.6 v61.3,65.5
  Bottom 0.203: v68.46,65.86 v68.36,48.54 | v73.25,74.05 73.25,74.41 71.12,76.54 66.23,76.54 v64.36,74.68 | v37.69,52.55 37.16,53.25 34.49,50.58 34.31,50.58 IC2.23 | v39,58.4 v39.1,61 | v46.2,66.6 46.8,66.2 51.9,66.2 52.1,66.1 55.2,66.1 v55.7,66 | v61.3,65.5 v65.14,69.34
BA4  (via drill 0.3, 0.3 pad 0.2)
  Top 0.203: v37.69,51.47 39.38,53.16 39.38,54.41 39.56,54.59 39.56,55.3 IC4.11 39.65,55.38 39.65,56.72 v39.74,56.81 | v75.12,45.52 72.63,43.03 71.92,43.03 IC5.6 | IC7.6 76.54,72.36 v76.54,66.23 76.54,66.14 77.25,65.43 77.25,62.94 76.1,61.78 70.23,61.78 60.54,71.48 57.43,71.48 57.16,71.21 v55.74,71.21 | v57.25,79.74 58.23,80.72 59.38,80.72 IC3.6 | v51.12,70.5 42.2,61.2 41.8,60.9 41,60.9 v40.1,60.2
  Bottom 0.203: v37.69,51.47 36.72,52.27 34.67,50.23 IC2.22 | v75.12,45.52 75.12,64.81 v76.54,66.23 | v57.25,79.74 57.25,76.9 55.74,75.39 v55.74,71.21 55.74,71.12 55.12,70.5 v51.12,70.5 | v40.1,60.2 39.9,59.9 v39.74,56.81
BA5  (via drill 0.3)
  Top 0.203: 44.05,54.54 44.09,54.59 44.09,55.3 IC4.2 | 44.05,54.54 v39.79,50.68 | v73.79,41.52 73.25,40.98 71.92,40.98 IC5.10 | v74.41,56.27 78.68,60.54 v81.5,63.4 | IC7.10 78.59,72.36 78.59,71.74 78.68,71.65 78.68,69.16 v81.52,69.16 | v65.96,80.28 64.54,81.7 59.47,81.7 IC3.8 | v44.63,53.96 44.05,54.54 | v54.76,49.61 v52.18,52.18
  Bottom 0.203: v39.79,50.68 35.74,50.58 35.03,49.87 IC2.21 | 73.79,43.74 73.79,45.78 73.61,45.96 73.61,55.47 v74.41,56.27 | 73.79,43.74 v73.79,41.52 | v65.96,80.28 69.61,80.28 72.01,77.88 80.01,77.88 81.52,76.36 v81.52,69.16 v81.5,63.4 | v44.63,53.96 45.16,53.96 45.5,53.5 46.3,53.5 48.1,55.2 49.5,53.8 50.6,52.5 51.1,52.3 51.5,52.2 v52.18,52.18 | v54.76,49.61 65.79,49.61 71.65,43.74 73.79,43.74
BA6  (via drill 0.3)
  Top 0.203: v39.03,49.87 39.03,51.21 42.05,54.23 42.05,55.3 IC4.6
  Bottom 0.203: v39.03,49.87 35.74,49.87 35.38,49.52 IC2.20
BA7  (via drill 0.3)
  Top 0.203: v32.98,48.72 31.65,50.05 30.94,50.05 IC4.33
  Bottom 0.203: v32.98,48.72 35.29,48.72 35.65,49.07 IC2.19
BA8  (via drill 0.3)
  Top 0.203: v38.49,48.98 41.52,45.96 41.52,43.29 v42.58,42.23 | v40.18,41.16 39.65,40.63 39.65,39.92 IC4.65
  Bottom 0.203: v38.49,48.98 38.32,49.16 36.45,49.16 36.09,48.81 IC2.18 | v42.58,42.23 42.14,42.23 41.07,41.16 v40.18,41.16
BA9  (via drill 0.3)
  Top 0.203: v38.85,44.01 38.85,43.12 39.2,42.76 39.2,40.01 39.12,39.92 IC4.64
  Bottom 0.203: v38.85,44.01 38.85,44.45 39.56,45.16 IC2.8
BA10  (via drill 0.3)
  Top 0.203: v41.25,48.01 41.25,50.76 v41.52,51.03 | v33.16,51.56 32.27,50.67 30.94,50.67 IC4.32
  Bottom 0.203: v41.25,48.01 41.25,46.14 40.01,44.9 IC2.7 | v41.52,51.03 41.52,53.52 40.36,54.67 36.27,54.67 v33.16,51.56
BA11  (via drill 0.3)
  Top 0.203: v38.05,42.23 34.94,42.23 v34.67,42.49 | v33.69,43.92 32.89,44.72 32.89,44.81 31.65,46.05 30.94,46.05 IC4.41
  Bottom 0.203: v38.05,42.23 40.27,44.45 IC2.6 | v34.67,42.49 34.67,42.94 v33.69,43.92
BA12  (via drill 0.3, 0.3 pad 0.2)
  Top 0.203: v42.23,51.84 v42.23,45.7 | 41.52,55.38 IC4.7 41.7,56.7 v41.9,57.9
  Bottom 0.203: v42.23,45.7 40.72,44.18 IC2.5 | v42.23,51.84 42.23,53.34 42.2,56.7 v41.9,57.9
BA13  (via drill 0.3, 0.3 pad 0.3)
  Top 0.203: v24.89,60.1 24.89,55.83 v28.27,52.45 | v29.52,49.52 30.85,49.52 IC4.34 | v52.2,44.4 v48.8,44.4
  Bottom 0.203: v24.89,60.1 28.8,60.1 31.11,62.41 42.41,62.41 43.74,61.07 43.74,51.47 47.6,47.9 48.4,47.9 49.2,47.1 50.4,47.1 50.8,46.5 51.3,45.3 v52.2,44.4 | v28.27,52.45 29.78,52.45 30.23,52.01 30.23,50.23 v29.52,49.52 | IC2.4 41.07,43.83 41.87,44.63 47.38,44.63 47.65,44.36 48.18,44.36 v48.8,44.4
BA14  (via drill 0.3)
  Top 0.203: v38.05,41.16 37.6,40.72 37.6,39.92 IC4.61
  Bottom 0.203: v38.05,41.16 39.12,41.16 41.34,43.38 IC2.3
BA15  (via drill 0.3)
  Top 0.203: v40.89,41.96 40.89,40.8 41.07,40.63 41.07,39.92 IC4.68
  Bottom 0.203: v40.89,41.96 40.89,42.23 41.69,43.03 IC2.2
BA16  (via drill 0.3)
  Top 0.203: v32.45,33.96 30.94,33.96 v30.67,33.69 | v21.87,54.23 v20.62,52.98 | v34.58,57.7 35.03,57.7 36.54,56.19 36.54,55.38 IC4.17
  Bottom 0.203: v32.45,33.96 32.45,33.78 35.12,31.11 35.65,31.11 36.01,31.47 39.29,31.47 45.52,37.69 45.52,38.23 43.56,40.18 43.56,42.23 42.85,42.94 42.32,42.94 42.14,42.76 IC2.1 | v30.67,33.69 15.73,33.69 8.89,40.54 8.89,44.27 16.27,51.65 19.29,51.65 v20.62,52.98 | v21.87,54.23 23.56,54.23 24.27,53.52 30.49,53.52 34.58,57.61 v34.58,57.7
BA17  (via drill 0.3)
  Top 0.203: v56.1,55.74 55.38,55.74 v54.67,55.03 | v49.87,60.19 49.87,60.81 48.9,61.78 47.3,61.78 v47.03,61.52 | v24.89,61.16 24.18,60.45 24.18,55.56 26.94,52.81 26.94,46.94 28.09,45.78 29.25,45.78 30.05,46.58 30.85,46.58 IC4.40
  Bottom 0.203: v56.1,55.74 55.74,56.1 55.74,56.27 IC2.48 | v54.67,55.03 52.45,55.03 49.87,57.61 v49.87,60.19 | v47.03,61.52 43.83,61.52 42.23,63.12 31.29,63.12 29.34,61.16 v24.89,61.16
BA18  (via drill 0.3)
  Top 0.203: v32.18,46.58 31.74,47.03 30.94,47.03 IC4.39
  Bottom 0.203: v32.18,46.58 31.47,47.3 31.47,47.83 31.91,48.27 32.45,48.27 32.72,48.01 36.01,48.01 36.36,48.36 IC2.17
BA19  (via drill 0.3)
  Top 0.203: v32.18,47.56 30.94,47.56 IC4.38
  Bottom 0.203: v32.18,47.56 36.27,47.56 36.72,48.01 IC2.16
BA20  (via drill 0.3)
  Top 0.203: 38.92,47.49 37.78,48.63 37.78,50.58 39.74,52.54 39.74,54.23 40.09,54.59 40.09,55.3 IC4.10 | 38.92,47.49 v39.83,46.58 | v34.05,45.78 34.05,46.67 31.65,49.07 30.94,49.07 IC4.35 | v35.77,45.58 35.92,45.78 36.09,45.61 36.83,45.41 38.92,47.49
  Bottom 0.203: v39.83,46.58 39.83,46.14 39.29,45.61 IC2.9 | v35.77,45.58 v34.05,45.78
BA21  (via drill 0.3)
  Top 0.203: v38.32,44.9 38.94,44.9 42.32,41.52 42.85,41.52 43.65,42.32 43.65,45.16 45.52,47.03 46.32,47.03 IC4.87
  Bottom 0.203: v38.32,44.9 38.32,45.34 38.85,45.87 IC2.10
BD0  (via drill 0.3)
  Top 0.203: v50.49,64.36 50.49,65.25 v52.27,67.03 | v53.7,68.45 53.7,73.17 55.38,74.85 55.38,76.28 IC3.60 55.38,76.36 55.38,76.99 55.3,77.08 v55.3,80.99 | v76.72,80.45 73.7,77.43 72.19,77.43 IC7.58 | v84.45,62.76 76.9,55.21 76.9,47.47 IC5.58 | v47.74,60.01 v47.74,56.1 | IC4.91 46.41,49.16 48.54,49.16 50.23,50.85 50.4,51.2 50.4,52.1 v51.03,53.11 | v86.87,78.88 v87.5,77.17
  Bottom 0.203: v50.49,64.36 50.23,64.36 48.98,63.12 IC2.29 48.9,63.03 47.74,61.87 v47.74,60.01 | v53.7,68.45 v52.27,67.03 | v55.3,80.99 56.19,81.88 70.94,81.88 72.36,80.45 v76.72,80.45 78.41,80.45 78.77,80.1 82.14,80.1 82.5,79.9 83.2,79.4 84.2,78.2 84.6,78.1 85.2,78.1 85.6,78.5 86.1,78.9 v86.87,78.88 | v84.45,62.76 84.45,72.72 86.2,74.3 87.6,75.7 v87.5,77.17 | v47.74,56.1 v51.03,53.11
BD1  (via drill 0.3)
  Top 0.203: v56.54,77.52 56.01,76.99 56.01,76.36 IC3.61 | IC7.61 72.1,75.92 71.39,75.92 71.16,75.94 v70.85,75.83 69.9,77.1 v69.88,78.23 | v48.45,60.72 48.45,56.81 v48.98,56.27 | v44.88,51.41 45.52,50.67 46.32,50.67 IC4.94 | 71.3,52.09 75.3,48.09 75.3,47.47 IC5.61 | v62.5,52.09 71.3,52.09 | v72.01,52.9 71.3,52.18 71.3,52.09
  Bottom 0.203: v69.88,78.23 63.56,78.23 61.34,80.45 56.98,80.45 56.54,80.01 v56.54,77.52 | v48.45,60.72 48.45,61.16 49.61,62.32 IC2.31 | v48.98,56.27 52.36,52.9 52.45,52.9 52.9,52.45 52.9,52.09 | 52.9,52.09 52.9,51.92 52.45,51.47 51.23,51.47 48.27,54.23 45.61,51.83 v44.88,51.41 | 52.9,52.09 v62.5,52.09 | v70.85,75.83 70.85,74.32 72.01,73.17 v72.01,52.9
BD2  (via drill 0.3)
  Top 0.203: v45.78,54.32 45.34,53.87 45.34,52.9 45.61,52.63 46.32,52.63 IC4.98 | v70.14,74.59 70.59,74.59 71.3,75.3 72.1,75.3 IC7.62 | IC3.62 56.45,76.28 56.45,74.94 57.43,73.97 v62.05,73.97 62.05,71.3 62.27,71.08 | v70.59,51.38 71.48,51.38 74.77,48.09 74.77,47.47 IC5.62 | 62.27,71.08 v70.59,62.76 | v51.74,63.03 51.74,65.08 v52.01,65.34 | v55.54,64.74 56.36,65.34 57.02,66.1 v59,65.3 | v62.83,70.53 62.27,71.08
  Bottom 0.203: v45.78,54.32 45.78,57.07 50.32,61.61 IC2.33 50.41,61.7 v51.74,63.03 | v62.05,73.97 66.05,73.97 66.67,74.59 v70.14,74.59 | v70.59,62.76 v70.59,51.38 | v62.83,70.53 v59,65.3 | v52.01,65.34 54.4,65.3 v55.54,64.74
BD3  (via drill 0.3, 0.3 pad 0.2)
  Top 0.203: v51.56,56.9 47.83,53.16 46.41,53.16 IC4.99 | v74.32,46.23 74.32,47.38 IC5.63 | v57.7,70.76 58.14,70.76 60.4,70.9 69.8,61.5 70.2,61.3 74.1,61.3 v74.3,61 | v57.7,74.68 57.7,74.94 56.98,75.65 56.98,76.28 IC3.63 | v73.25,76.1 73.25,75.39 72.72,74.85 72.19,74.85 IC7.63 | v53.78,62.94 53.78,63.65 53.34,64.1 53.34,64.63 56.19,67.47 v57.7,67.47 | v74.3,57.9 74,57.7 73.5,57.2 73.5,55.3 v74.32,54.59
  Bottom 0.203: v51.56,56.9 50.58,57.87 50.58,60.45 51.03,60.9 IC2.35 51.12,60.98 53.07,62.94 v53.78,62.94 | v74.32,54.59 v74.32,46.23 | v73.25,76.1 72.72,76.1 71.3,77.52 59.56,77.52 57.7,75.65 v57.7,74.68 v57.7,70.76 57.7,70.67 57.34,70.32 57.34,68.19 57.7,67.83 v57.7,67.47 | v74.3,61 v74.3,57.9
BD4  (via drill 0.3)
  Top 0.203: v58.05,68.45 56.63,68.45 52.98,64.81 52.98,62.76 53.16,62.59 v53.16,60.54 53.16,59.47 54.32,58.32 54.5,58.32 56.81,56.01 56.81,55.47 55.65,54.32 v55.38,54.32 | v58.41,75.39 57.52,76.28 IC3.64 | v68.72,72.19 70.85,74.32 72.1,74.32 IC7.64 | v69.88,50.67 71.56,50.67 73.79,48.45 73.79,47.47 IC5.64 | v49.96,56.27 47.3,53.61 46.41,53.61 IC4.100
  Bottom 0.203: v53.16,60.54 52.81,60.54 52.18,59.92 IC2.38 | v58.05,68.45 58.05,70.14 58.41,70.5 58.41,72.1 | v58.41,75.39 58.41,72.1 | 58.41,72.1 60.19,72.1 60.27,72.19 v68.72,72.19 69.08,72.19 69.88,71.39 v69.88,50.67 | v49.96,56.27 50.67,56.27 52.63,54.32 v55.38,54.32
BD5  (via drill 0.3)
  Top 0.203: v58.23,77.79 58.94,77.79 59.38,78.23 IC3.1 | v66.67,50.85 67.03,50.85 71.83,46.05 71.83,45.52 IC5.1 | v69.08,71.21 70.59,71.21 71.74,72.36 73.97,72.36 IC7.1 | v47.03,57.25 44.72,57.25 43.65,56.19 43.65,55.38 IC4.3 | v49.25,57.25 50.94,57.25 v52.01,58.32
  Bottom 0.203: 56.45,64.45 56.45,75.56 58.23,77.34 v58.23,77.79 | 56.45,64.45 56.45,62.76 52.9,59.21 IC2.40 52.81,59.12 v52.01,58.32 | v66.67,50.85 66.67,55.92 60.23,62.36 | 60.23,62.36 58.14,64.45 56.45,64.45 | 60.23,62.36 v69.08,71.21 | v49.25,57.25 v47.03,57.25
BD6  (via drill 0.3)
  Top 0.203: v51.3,59.03 50.05,59.03 49.16,59.92 49.16,60.98 48.72,61.43 48.18,61.43 43.12,56.36 43.12,55.38 IC4.4 | 70.01,48.49 66.94,51.56 62.94,51.56 62.76,51.38 62.23,51.38 v54.59,59.03 | 70.01,48.49 72.81,45.7 72.81,45.25 72.54,44.98 71.92,44.98 IC5.2 | v73.88,69.08 74.5,69.7 74.5,72.36 IC7.2 | 70.01,48.49 v71.39,49.87 | v58.23,78.77 59.38,78.77 IC3.2 | v57.16,65.16 57.16,63.92 v57.34,63.74
  Bottom 0.203: v51.3,59.03 51.3,58.05 51.74,57.61 52.72,57.61 53.52,58.41 IC2.42 53.61,58.5 54.14,59.03 v54.59,59.03 54.59,59.12 57.34,61.87 v57.34,63.74 | v73.88,69.08 73.88,68.9 72.72,67.74 72.72,51.21 v71.39,49.87 | v58.23,78.77 58.94,78.05 58.94,77.43 56.98,75.48 56.98,65.34 v57.16,65.16
BD7  (via drill 0.3)
  Top 0.203: v53.25,57.16 53.25,58.05 49.78,61.52 49.78,64.81 49.34,65.25 48.81,65.25 45,61.3 44.7,61.2 43.5,59.7 43.5,57.5 42.6,56.5 IC4.5 42.67,55.38 | v73.08,44.45 IC5.3 | v75.03,65.7 75.03,72.36 IC7.3 | v58.23,79.74 58.67,79.3 59.38,79.3 IC3.3 | v62.59,78.23 62.59,77.43 65.96,74.05 65.96,69.34 71.56,63.74 v73.43,63.74
  Bottom 0.203: v53.25,57.16 53.7,57.16 54.23,57.7 IC2.44 54.32,57.78 55.92,59.38 59.3,59.38 63.21,55.47 63.21,50.67 63.74,50.14 65.79,50.14 71.48,44.45 v73.08,44.45 73.08,63.3 73.48,63.7 | v75.03,65.7 75.03,65.25 73.48,63.7 | v58.23,79.74 61.07,79.74 v62.59,78.23 | v73.43,63.74 73.48,63.7
BIP  (via drill 0.3)
  Top 0.203: v4.8,66.85 5.47,67.52 | 5.47,67.52 8.18,70.23 R4.2 | v34.37,41.52 35.56,40.73 35.56,39.92 IC4.57 | 5.47,67.52 v7.91,65.08
  Bottom 0.203: v4.8,66.85 4.45,66.85 1.6,64.01 JP1.4 | v34.37,41.52 33.52,41.52 29.07,45.96 29.07,46.76 23.38,52.45 22.14,52.45 16.36,58.23 10.49,58.23 7.91,60.81 v7.91,65.08
BRD  (via drill 0.3)
  Top 0.203: v40.72,56.72 40.63,56.63 40.63,55.38 IC4.9 | v43.03,60.54 45.61,63.12 v45.7,63.12 45.7,64.1 51.92,70.32 51.92,76.28 IC3.53 52.01,76.36 52.01,77.61 v53.7,79.3 | v79.3,51.21 79.3,47.47 IC5.53 | v76.54,64.01 74.14,65.21 74.14,67.74 71.39,70.5 68.81,70.5 68.01,71.3 68,72.7 69.2,73.7 69.2,77.7 v68.47,78.94 69.25,79.39 71.03,79.39 71.48,79.83 72.1,79.83 IC7.53
  Bottom 0.203: v45.7,63.12 45.96,62.85 48.01,62.85 48.54,63.39 IC2.28 | v40.72,56.72 40.72,58.23 v43.03,60.54 | v79.3,51.21 79.3,61.25 v76.54,64.01 | v53.7,79.3 55.3,79.3 56.81,80.81 64.01,80.81 65.88,78.94 v68.47,78.94
BWR  (via drill 0.3)
  Top 0.203: v40.45,53.61 40.45,53.96 41.07,54.59 41.07,55.3 IC4.8 | v53.7,80.28 51.47,78.05 51.47,76.36 IC3.52 | v70.47,81.17 71.58,80.37 72.1,80.37 IC7.52 | v80.01,50.49 79.92,50.41 79.92,47.47 IC5.52 | v79.21,75.48 77.79,76.9 77.79,79.39 v78.14,79.74 | v47.92,45.07 57.7,45.07 v61.61,41.16 | v69.96,37.25 72.81,37.25 78.05,42.49 78.05,44.45 v78.41,44.81
  Bottom 0.203: 43.74,49.16 43.29,48.72 40.98,48.72 38.58,46.32 IC2.11 | 43.74,49.16 43.74,49.7 43.12,50.32 41.25,50.32 40.8,50.76 40.8,53.25 v40.45,53.61 | v53.7,80.28 55.74,80.28 56.63,81.17 v70.47,81.17 70.56,81.27 72.19,79.74 v78.14,79.74 | v79.21,75.48 80.01,74.68 v80.01,50.49 80.01,50.41 78.41,48.81 v78.41,44.81 | v47.92,45.07 43.83,49.16 43.74,49.16 | v61.61,41.16 65.52,37.25 v69.96,37.25
CLK_ENC
  Top 0.203: C25.1 12,7.38 14.4,7.38 15.73,8.71 X7.P$2 15.82,8.89 19.91,12.98 21.51,12.98 UU1.3
CLOCK  (via drill 0.3)
  Top 0.203: C10.2 16.98,39.65 20,39.65 20.89,40.54 X4.P$2 20.98,40.63 21.87,41.52 28.09,41.52 | 28.09,41.52 30.85,41.52 IC4.50 | v49.25,82.77 48.01,82.77 IC3.39 | v53.43,81.88 v52.01,81.88 | v80.72,82.23 80.72,81.7 v79.83,80.81 | IC7.31 83.48,81.34 82.86,81.34 82.32,80.81 v81.79,80.81 81.79,80.72 80.81,79.74 v80.81,76.1 | v80.81,40.8 80.81,36.01 IC5.31 80.81,35.92 v80.81,34.76 | v28.09,36.01 28.09,41.52 | v70.85,28.45 v55.83,28.45
  Bottom 0.203: v49.25,82.77 49.25,82.59 49.96,81.88 v52.01,81.88 | v53.43,81.88 55.65,81.88 56.01,82.23 v80.72,82.23 | v81.79,80.81 v79.83,80.81 | v80.81,76.1 v80.81,40.8 | v28.09,36.01 28.09,35.03 28.71,34.4 31.03,34.4 36.18,29.25 39.38,29.25 40.18,28.45 v55.83,28.45 | v70.85,28.45 74.5,28.45 v80.81,34.76
CTS  (via drill 0.3)
  Top 0.203: v43.03,86.23 48.63,86.23 51.3,83.57 51.3,79.03 51.03,78.77 51.03,76.36 IC3.51 | v38.41,81.61 36.63,79.83 33.69,79.83 33.07,80.45 33.07,86.77 32.63,87.21 32.09,87.21 31.47,86.59 31.47,85.79 IC6.9
  Bottom 0.203: v38.41,81.61 v43.03,86.23
D2+  (via drill 0.3)
  Top 0.203: v49.16,83.74 IC3.37 | v39.29,84.54 v40.8,83.03 | CN2.D+ 7.91,81.97 10.58,81.97 v11.29,82.68 11.29,82.77 12.89,84.37 12.89,87.92 R32.1
  Bottom 0.203: v49.16,83.74 47.83,83.74 47.3,84.28 45.52,84.28 44.27,83.03 v40.8,83.03 | v39.29,84.54 36.09,84.54 34.58,83.03 33.6,81.9 28.3,81.9 27.1,83.1 25.5,83.1 20.4,78 16,78 v11.29,82.68 11.65,83.03
D2-  (via drill 0.3)
  Top 0.203: v29.87,77.25 30.58,76.54 48.27,76.54 50.94,79.21 50.94,82.94 49.43,84.45 48.9,84.45 48.72,84.28 48.01,84.28 IC3.36 | CN2.D- 7.91,82.68 v10.31,82.68 10.31,82.77 10.58,83.03 10.58,87.92 R31.1
  Bottom 0.203: v29.87,77.25 15.73,77.25 v10.31,82.68
D+  (via drill 0.3, 0.3 pad 0.3)
  Top 0.203: 10.67,42.85 9.96,42.85 9.34,42.23 7.91,42.23 CN1.D+ | 10.67,42.85 11.65,42.85 R1.1 | 10.67,42.85 v10.67,41.87 | 34.58,39.83 IC4.55 34.5,38.7 34.2,38.1 34,37.8 33.2,37.7 v32.35,37.78
  Bottom 0.203: v32.35,37.78 14.76,37.78 v10.67,41.87
D-  (via drill 0.3)
  Top 0.203: 10.31,44.01 10.31,43.74 9.6,43.03 7.91,43.03 CN1.D- | 10.31,44.01 10.31,45.34 11.73,46.76 11.73,47.3 R2.1 | v33.58,38.49 34.05,38.76 34.05,39.83 IC4.54 | 10.31,44.01 v10.58,44.01
  Bottom 0.203: v33.58,38.49 31.65,38.49 30.76,39.38 15.2,39.38 v10.58,44.01
DA0
  Top 0.203: IC4.58 36.18,39.83 36.18,32.41 37.87,30.23 37.87,26.4 39.03,25.25 39.38,25.25 40.45,24.18 40.45,23.02 41.34,22.14 48.54,22.14 50.58,24.18 50.58,24.62 51.21,25.25 54.67,25.25 55.65,24.27 55.65,23.82 56.27,23.2 63.3,23.2 64.28,24.18 JP2.35
DA1  (via drill 0.3)
  Top 0.203: v48.83,51.82 47.38,51.56 46.41,51.56 IC4.96 | v53.16,46.05 v53.16,47.83
  Bottom 0.203: v48.83,51.82 52.02,48.83 v53.16,47.83 | v53.16,46.05 62.85,36.36 62.85,25.25 61.87,24.27 JP2.33
DA2  (via drill 0.3)
  Top 0.203: v48.61,52.92 47.83,52.09 46.41,52.09 IC4.97
  Bottom 0.203: v48.61,52.92 50.94,51.12 59.03,43.03 59.03,41.69 64.01,36.72 64.01,27.11 64.28,26.85 JP2.36
DACK
  Top 0.203: IC4.71 42.67,39.83 42.67,37.87 42.7,35.9 42.9,35.4 42.9,34.5 43.1,34.1 43.3,33.9 46.5,33.9 46.7,34.2 48.18,34.23 55.3,27.11 55.3,25.69 56.72,24.27 JP2.29
DCD  (via drill 0.3)
  Top 0.203: v41.25,85.97 45.96,81.25 47.92,81.25 IC3.42 | v27.2,91.83 27.2,94.94 28.27,96.01 JP8.1
  Bottom 0.203: v41.25,85.97 41.25,88.54 38.23,91.57 27.47,91.57 v27.2,91.83
DCS  (via drill 0.3 pad 0.2)
  Top 0.203: IC4.72 43.1,36.7 43.6,35.2 44.6,34.8 v45.6,34.6 | v44.3,32.1 47.2,29 48,28.2 53.1,28.1 JP2.28
  Bottom 0.203: v45.6,34.6 v44.3,32.1
DD0  (via drill 0.3)
  Top 0.203: v31.83,55.83 32.27,55.38 32.54,55.38 IC4.25 | v22.31,22.05 21.43,22.05 v18.76,24.71 | v17.69,30.23 v17.69,25.78 | v17.07,56.45 19.91,56.45 21.25,57.78 X2.1
  Bottom 0.203: v31.83,55.83 31.83,56.36 29.52,58.67 28.54,58.67 27.65,57.78 21.34,57.78 X2.1 | v22.31,22.05 38.23,22.05 40.36,24.18 41.43,24.18 JP2.17 | v17.69,25.78 v18.76,24.71 | v17.69,30.23 17.69,30.67 8.18,40.18 8.18,46.23 15.02,53.07 15.02,54.41 v17.07,56.45
DD1  (via drill 0.3)
  Top 0.203: IC4.24 33.07,55.38 33.07,56.1 32.63,56.54 29.69,56.54 v27.29,58.94 27.29,59.03 27.91,59.65 v27.91,64.54 | v64.01,39.74 v61.25,36.98 | v64.01,50.85 v64.01,48.9 | v64.99,56.63 64.99,57.16 65.61,57.78 65.61,62.76 59.21,69.16 v54.41,69.16
  Bottom 0.203: v27.29,58.94 21.34,58.94 X2.2 | v61.25,36.98 58.23,33.96 58.23,26.76 57.16,25.69 41.34,25.69 39.92,24.27 39.03,24.27 JP2.15 | v64.01,48.9 v64.01,39.74 | v64.01,50.85 64.01,55.65 v64.99,56.63 | v54.41,69.16 32.54,69.16 v27.91,64.54
DD2  (via drill 0.3)
  Top 0.203: v32.63,53.61 33.52,54.5 33.52,55.3 IC4.23 | v26.23,46.67 v26.23,52.45 | v26.23,40.09 26.23,28.71 25.16,27.65 25.16,26.4 26.31,25.25 26.67,25.25 27.74,24.18 27.74,23.82 28.89,22.67 31.29,22.67 32.8,24.18 32.8,24.62 33.43,25.25 35.38,25.25 36.36,24.27 JP2.13
  Bottom 0.203: v32.63,53.61 31.11,53.61 30.67,53.16 26.94,53.16 v26.23,52.45 | v26.23,40.09 v26.23,46.67
DD3  (via drill 0.3)
  Top 0.203: v29.96,57.25 32.98,57.25 34.05,56.19 34.05,55.38 IC4.22 | v21.6,51.3 v24.54,54.23 | v14.22,43.92 14.22,35.2 22.31,27.11 22.31,24.18 24.18,22.31 31.91,22.31 33.78,24.18 JP2.11
  Bottom 0.203: v29.96,57.25 28.18,57.25 25.16,54.23 v24.54,54.23 | v14.22,43.92 v21.6,51.3
DD4  (via drill 0.3)
  Top 0.203: v34.76,43.92 34.76,46.05 34.67,46.14 34.67,55.3 IC4.21 | v35.07,38.2 35.37,37.6 35.43,36.95 35.43,35.08 31.47,31.03 v31.47,30.49
  Bottom 0.203: v34.76,43.92 34.76,43.38 35.47,42.67 35.4,42.1 35.1,41.8 35.1,39 v35.07,38.2 | v31.47,30.49 31.47,30.14 33.34,28.27 33.34,27.74 32.36,26.76 32.36,25.25 31.38,24.27 JP2.9
DD5  (via drill 0.3 pad 0.3)
  Top 0.203: IC4.20 35.1,44.6 v35.8,44.2 | v25.1,29.2 v25.1,36.7 | v31.4,35.6 32.8,36.6 v33.6,37
  Bottom 0.203: v35.8,44.2 36,42.1 35.5,41.6 35.5,39.4 35.8,38.7 35.8,37.9 35.5,37.6 35.3,37.5 34.6,37.5 v33.6,37 | JP2.7 30.2,25.7 30.3,26.3 30.3,27.3 28.3,29.3 28,29.5 25.2,29.5 v25.1,29.2 | v25.1,36.7 25.8,37.1 30.3,37.1 30.9,35.9 v31.4,35.6
DD6
  Top 0.203: IC4.26 27.03,57.43 26.94,57.43 25.6,58.76 25.6,61.43 23.56,63.48 15.11,63.48 12.62,60.98 10.49,60.98 7.02,57.52 7.02,52.36 11.11,48.27 12.54,48.27 14.94,45.87 14.94,36.8 21.16,30.58 21.34,30.58 24.8,27.11 24.8,25.69 26.23,24.27 JP2.5
DD7  (via drill 0.3)
  Top 0.203: v27.65,47.21 27.65,50.85 29.87,53.07 30.85,53.07 IC4.27 | v27.38,40.09 27.38,28.89 v26.58,28.09
  Bottom 0.203: v27.65,47.21 27.65,40.36 v27.38,40.09 | v26.58,28.09 28.98,28.09 29.87,27.2 29.87,26.4 28.71,25.25 24.71,25.25 23.74,24.27 JP2.3
DD8  (via drill 0.3)
  Top 0.203: v29.25,57.96 32.8,57.96 33.78,56.98 35.2,56.98 36.09,56.1 36.09,55.38 IC4.18 | v20.27,55.83 18.4,55.83 16.36,53.78 v15.73,53.78 | v21.07,29.87 21.07,29.43 23.65,26.85 JP2.4
  Bottom 0.203: S1.CD 17.96,13.6 16.18,11.82 13.25,11.82 11.91,13.16 11.91,22.58 15.82,26.49 20,26.49 20.8,25.69 22.58,25.69 23.65,26.76 JP2.4 | v29.25,57.96 28.36,57.96 26.23,55.83 v20.27,55.83 | v15.73,53.78 15.73,51.65 8.53,44.45 8.53,40.36 19.02,29.87 v21.07,29.87
DD9  (via drill 0.3)
  Top 0.203: v36.56,46.32 35.65,47.03 35.65,55.3 IC4.19 | v37.25,35.29 v37.25,37.96 | v28.8,35.29 28.8,29.34 26.31,26.85 JP2.6
  Bottom 0.203: v36.56,46.32 36.56,41.96 36.89,41.43 36.89,38.32 v37.25,37.96 | v28.8,35.29 29.5,34.9 30.9,34.8 31.8,34.6 32.4,34.7 33.1,34.7 33.6,35.3 34.2,35.2 34.5,34.9 34.8,34.7 36,34.8 36.4,34.7 v37.25,35.29
DD10  (via drill 0.3)
  Top 0.203: v41.34,37.25 41.52,37.43 41.52,39.83 IC4.69 | v34.97,33.25 35.17,33.12 28.8,26.85 JP2.8
  Bottom 0.203: S1.5 13.6,13.69 13.6,14.85 21.96,23.2 22.05,23.2 22.67,23.82 22.67,24.71 23.65,25.69 27.65,25.69 28.71,26.76 JP2.8 | v41.34,37.25 40.18,37.25 36.98,34.05 v34.97,33.25
DD11  (via drill 0.3)
  Top 0.203: v42.05,35.2 42.05,39.83 IC4.70 | v35.38,31.83 31.38,27.83 31.38,26.85 JP2.10
  Bottom 0.203: S1.3 11.38,13.69 11.38,22.58 17.6,28.8 22.6,28.8 24.1,30.2 27.9,30.2 29.34,28.8 31.29,26.85 JP2.10 | v42.05,35.2 38.67,31.83 v35.38,31.83
DD12  (via drill 0.3)
  Top 0.203: v32.63,28 33.78,26.85 JP2.12 | v44.81,37.96 45.07,38.23 45.07,40.63 44.98,40.72 44.98,42.49 45.52,43.03 46.32,43.03 IC4.79 | v32.95,35.6 33.25,33.69 v30.76,31.2
  Bottom 0.203: v32.63,28 31.47,29.16 30.76,29.16 30.76,30.7 | S1.2 10.31,13.69 10.31,22.05 17.42,29.16 22.1,29.2 23.8,30.7 30.76,30.7 | v44.81,37.96 38.94,37.96 36.8,35.83 36.3,35.2 36,35.2 35.2,35.1 34.8,35.2 34.4,35.5 34.1,35.7 33.43,35.83 v32.95,35.6 | 30.76,30.7 v30.76,31.2
DD13  (via drill 0.3)
  Top 0.203: v47.92,42.76 47.12,43.56 46.41,43.56 IC4.80 | v38.58,28.54 v39.83,29.78
  Bottom 0.203: v47.92,42.76 47.92,41.25 48.72,40.45 48.72,38.67 v39.83,29.78 | v38.58,28.54 38.14,28.54 36.45,26.85 JP2.14
DD14  (via drill 0.3)
  Top 0.203: v30.76,32.18 29.96,32.98 29.96,38.76 31.91,40.72 31.91,42.76 31.56,43.12 30.94,43.12 IC4.47